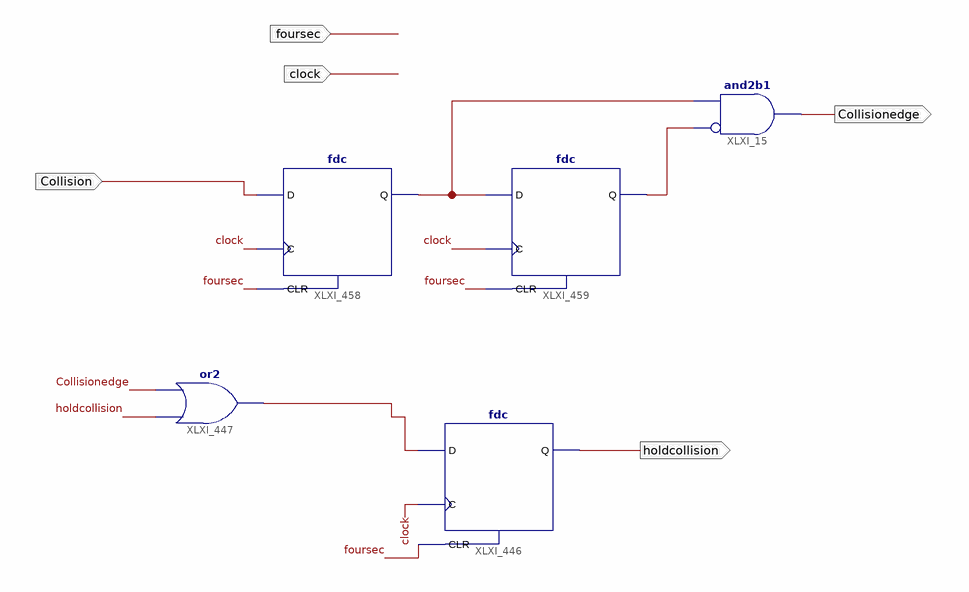
[diagram p0: schematic sheet 1]
// Xilinx ISE schematic collisionedge.sch (spartan3e) as structural Verilog: 5 symbols, 5 ports
module collisionedge (
  input  clock,
  input  foursec,
  input  Collision,
  output Collisionedge,
  output holdcollision
);

  wire XLXN_1070, XLXN_1087, XLXN_1088;

  and XLXI_15 (Collisionedge, ~XLXN_1088, XLXN_1087);  // and2b1
  fdc XLXI_446 (.C(clock), .CLR(foursec), .D(XLXN_1070), .Q(holdcollision));
  or XLXI_447 (XLXN_1070, holdcollision, Collisionedge);
  fdc XLXI_458 (.C(clock), .CLR(foursec), .D(Collision), .Q(XLXN_1087));
  fdc XLXI_459 (.C(clock), .CLR(foursec), .D(XLXN_1087), .Q(XLXN_1088));
endmodule
